# EAGLE design NOT Gate (EAGLE 6.5.0)
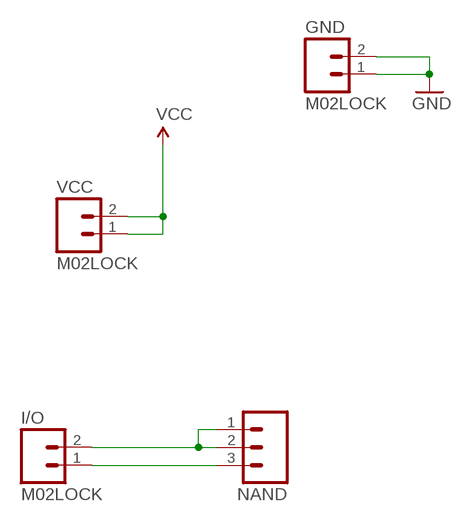
[diagram p0: schematic, sheet 1]

## Parts
GND  M02LOCK  [1X02_LOCK]
I/O  M02LOCK  [1X02_LOCK]
NAND  M03LOCK  [1X03_LOCK]
VCC  M02LOCK  [1X02_LOCK]

## Nets
GND: GND.1 GND.2
N$1: I/O.2 NAND.1 NAND.2
N$2: I/O.1 NAND.3
VCC: VCC.1 VCC.2

## Library data of the parts
GND I/O VCC = SparkFun-Connectors:M02: Standard 2-pin 0.1" header. Use with - straight break away headers ( PRT-00116) - right angle break away headers (PRT-00553) - swiss pins (PRT-00743) - machine pins (PRT-00117) - female headers (PRT-00115) Molex polarized connector foot print use with: PRT-08233 with associated crimp pins and housings. 2.54_SCREWTERM for use with PRT-10571. 3.5mm Screw Terminal footprints for PRT-08084 5mm Screw Terminal footprints for use with PRT-08433
NAND = SparkFun-Connectors:M03: Header 3 Standard 3-pin 0.1" header. Use with straight break away headers (SKU : PRT-00116), right angle break away headers (PRT-00553), swiss pins (PRT-00743), machine pins (PRT-00117), and female headers (PRT-00115). Molex polarized connector foot print use with SKU : PRT-08232 with associated crimp pins and housings.

## Board
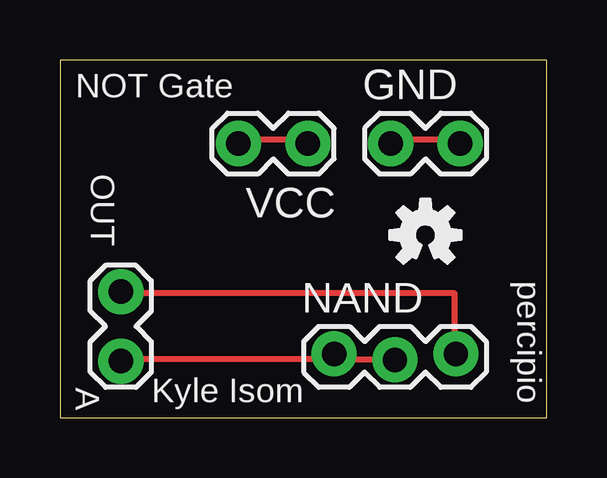
[diagram p1: board, top side]

Size 20.3 x 14.91 mm. Coordinates in mm from the lower left corner, seen from the top.
Outline: 0,0 20.3,0 20.3,14.91 0,14.91 0,0
Copper layers (1*16): Top 0.035mm / dielectric 1.5mm / Bottom 0.035mm
Design rules "default": minimum track width 10mil, minimum drill 24mil, track to track 8mil, track to pad 8mil, pad to pad 8mil, via to via 8mil, smd to smd 8mil, copper to edge 40mil, drill to drill 8mil, minimum pad ring 10mil, minimum via ring 8mil, stop-mask expansion 4mil, vias tented up to drill 0mil, thermal gap 10mil

### Footprints (pad centres in the part's own frame; a part is rotated, then mirrored left to right if it is on the bottom)
1X02_LOCK = drill 1.016 pad 1.88: 1 -0.178,0; 2 2.718,0
1X03_LOCK = drill 1.016 pad 1.88: 1 0,0.127; 2 2.54,-0.127; 3 5.08,0.127

### Placement (x,y rotation side)
GND  13.97,11.43 0 top
I/O  2.54,5.08 270 top
NAND  11.43,2.54 0 top
U$1  [OSHW-LOGO-S]  15.24,7.62 0 top
VCC  10.16,11.43 180 top

### Tracks (layer width: path | path; a pad name or v marks a point on that pad's centre or on a via)
GND
  Top 0.254: GND.1 14.02,11.58 16.46,11.58 GND.2
N$1
  Top 0.254: I/O.2 2.74,2.44 11.28,2.44 NAND.1 11.58,2.44 13.72,2.44 NAND.2
N$2
  Top 0.254: I/O.1 2.74,5.18 16.46,5.18 16.46,2.74 NAND.3
VCC
  Top 0.254: VCC.2 7.62,11.58 10.06,11.58 VCC.1

### Text on the board
tPlace: NOT Gate | OUT | percipio | A | Kyle Isom